# Altium schematic sheet PCB_Schematic_Sheet_3.SchDoc
size A4
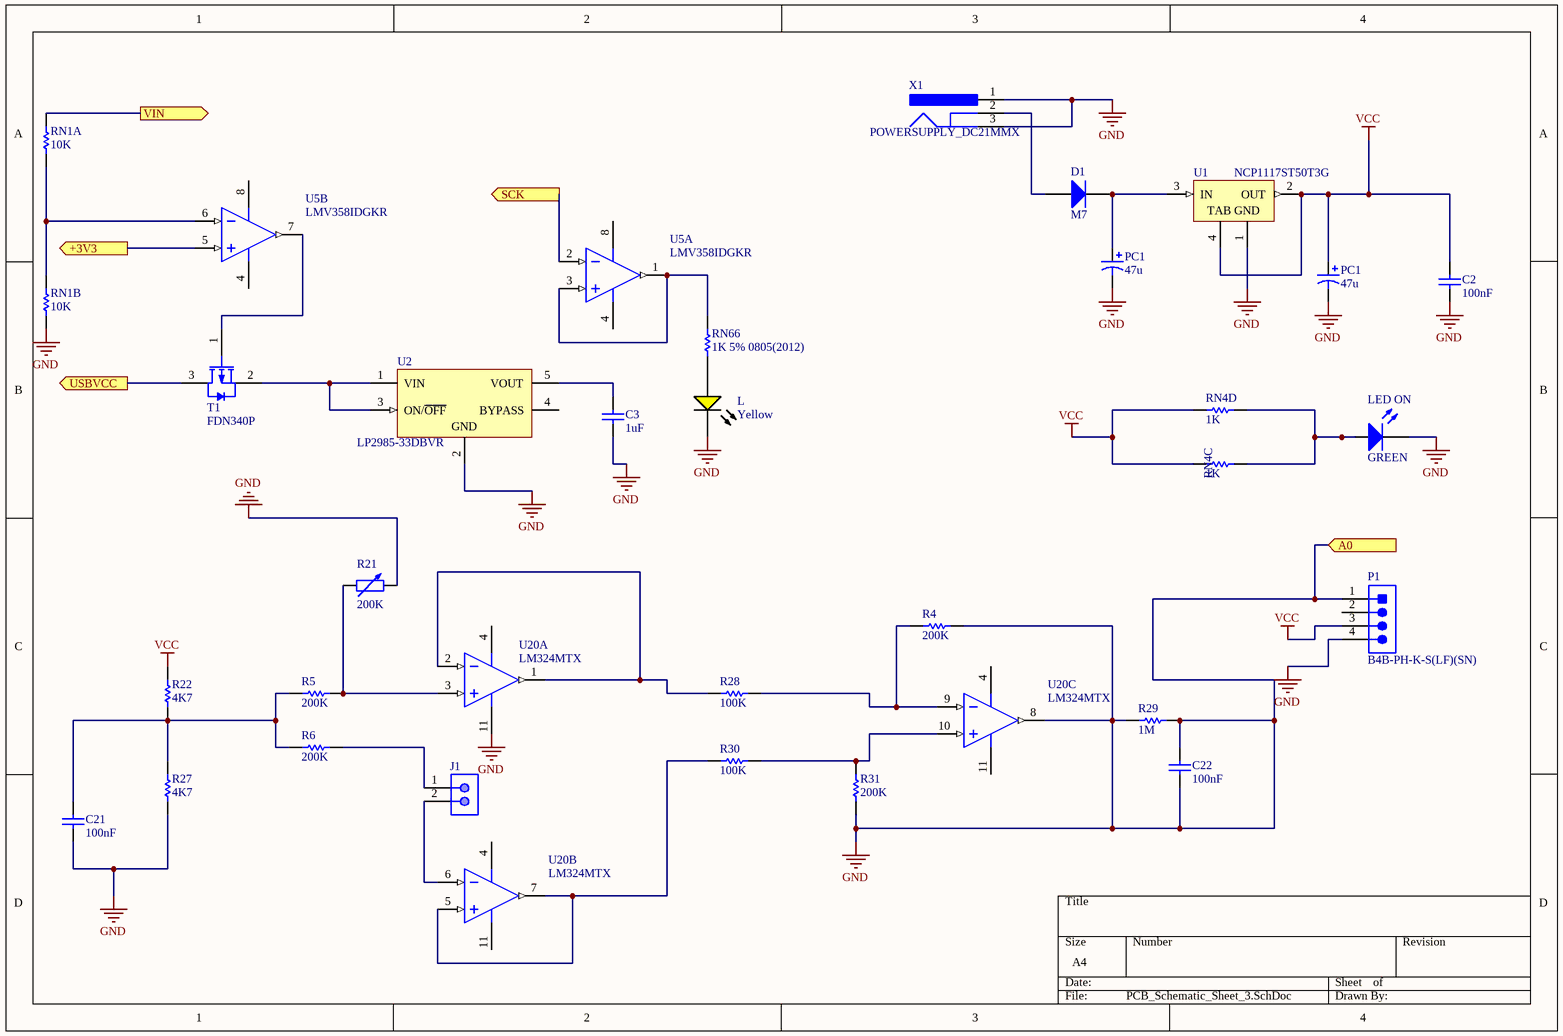
[diagram p0: PCB_Schematic_Sheet_3.SchDoc]

## Parts
(Parts that share a designator on the sheet are numbered #1, #2 ... from top to bottom, then left to right.)
C2  100nF  [CAPC0805(2012)100_M]
C3  1uF  [CAPC0805(2012)145_L]
C21  100nF  [CAPC0603(1608)100_L]
C22  100nF  [CAPC0603(1608)100_L]
D1  M7  [BOUR-CD1206-S01575-2_L]
J1  (no value)  [JST-B2B-XH-A_V]
L  Yellow  [LTST-C190KSKT_V]
LED_ON  GREEN  [3.2X1.6X1.1]
P1  B4B-PH-K-S(LF)(SN)  [JST-B4B-PH-K-S_V]
PC1#1  47u  [PNSC-ECA-1HM470]
PC1#2  47u  [PNSC-ECA-1HM470]
R4  200K  [RESC0603(1608)_M]
R5  200K  [RESC0603(1608)_M]
R6  200K  [RESC0603(1608)_M]
R21  value 200K  [AXIAL-0.6]
R22  4K7  [RESC0603(1608)_N]
R27  4K7  [RESC0603(1608)_N]
R28  100K  [RESC0603(1608)_N]
R29  1M  [RESC0603(1608)_L]
R30  100K  [RESC0603(1608)_N]
R31  200K  [RESC0603(1608)_M]
RN1A  10K  [RESC0805(2012)_M]
RN1B  10K  [RESC0805(2012)_M]
RN4C  1K  [RESC0805(2012)_N]
RN4D  1K  [RESC0805(2012)_N]
RN66  1K 5% 0805(2012)  [RESC0805(2012)_N]
T1  FDN340P  [FAIR-SSOT3L-3_V]
U1  NCP1117ST50T3G  [ONSC-SOT-223_N]
U2  LP2985-33DBVR  [DBV0005A_M]
U5  LMV358IDGKR  [DGK0008A_M]  (parts A,B of 2)
U20  LM324MTX  [PW0014A_N]  (parts A,B,C of 4)
X1  POWERSUPPLY_DC21MMX  [CUI-PJ-102A_V]

## Ports
+3V3 (out), A0 (in), SCK (out), USBVCC (out), VIN (out)

## Nets
GND: C2.1 C3.1 C21.1 C22.1 C22.2 L.2(K) LED_ON.2(K) P1.1 P1.4 PC1#1.2(-) PC1#2.2(-) R4.2 R21.2 R27.1 R29.1 R29.2 R31.1 RN1B.1 U1.1(GND) U2.2(GND) U20.8(OUT3) U20.11(GND) X1.1 X1.3 ; port A0
VCC: C2.2 P1.3 PC1#2.1(+) R22.2 RN4C.1 RN4D.1 U1.2(OUT) U1.4(TAB)
+3V3: U5.5(2IN+) ; port +3V3
SCK: U5.2(1IN-) ; port SCK
USBVCC: T1.3(DRAIN) ; port USBVCC
VIN: RN1A.2 ; port VIN
NetC3_2: C3.2 U2.5(VOUT)
NetC21_2: C21.2 R5.1 R6.1 R22.1 R27.2
NetD1_1: D1.1(A) X1.2
NetD1_2: D1.2(K) PC1#1.1(+) U1.3(IN)
NetJ1_1: J1.1 R6.2
NetJ1_2: J1.2 U20.6(IN2-)
NetL_1: L.1(A) RN66.1
NetLED_ON_1: LED_ON.1(A) RN4C.2 RN4D.2
NetR4_1: R4.1 R28.2 U20.9(IN3-)
NetR5_2: R5.2 R21.1 U20.3(IN1+)
NetR28_1: R28.1 U20.1(OUT1) U20.2(IN1-)
NetR30_1: R30.1 U20.5(IN2+) U20.7(OUT2)
NetR30_2: R30.2 R31.2 U20.10(IN3+)
NetRN1A_1: RN1A.1 RN1B.2 U5.6(2IN-)
NetRN66_2: RN66.2 U5.1(1OUT) U5.3(1IN+)
NetT1_1: T1.1(GATE) U5.7(2OUT)
NetT1_2: T1.2(SOURCE) U2.1(VIN) U2.3(ON/~{OFF})

Not connected (* = marked no-connect by the designer): P1 2; U2 4(BYPASS); U5 4(GND) 8(VCC+); U20 4(V+)

## Library data of the parts
C2 = CMP-1036-04420-1: CAP 100nF 50V ±10% 0805 (2012 Metric) Thickness 1mm SMD; Case-EIA: 0805; Tolerance: Â±10%; Case-Metric: 2012; Rated Voltage: 50 V; Value: 100nF; Max Thickness: 1 mm; Technology: SMT
C3 = CMP-1036-04761-1: CAP 1uF 50V ±10% 0805 (2012 Metric) Thickness 1.45mm SMD; Tolerance: Â±10%; Case-EIA: 0805; Case-Metric: 2012; Technology: SMT; Value: 1uF; Max Thickness: 1.45 mm; Rated Voltage: 50 V
C21 C22 = CMP-1035-02591-1: CAP 100nF 50V ±5% 0603 (1608 Metric) Thickness 1mm SMD; Tolerance: Â±5%; Case-Metric: 1608; Case-EIA: 0603; Rated Voltage: 50 V; Max Thickness: 1 mm; Technology: SMT; Value: 100nF
D1 = CMP-0583-00001-2: 75 V Small Signal Switching Diode, 150 mA, 2.5 uA, 1026 Molded Package, RoHS, Tape and Reel; Manufacturer: Bourns; PartNumber: CD1206-S01575; Reverse Voltage: 75 V; Average Forward Current: 150 mA; Reverse Current (Max.): 2.5 uA; Capacitance Between Terminals (Max.): 3 pF; Reverse Recovery Time (Max.): 4 nS; Forward Voltage (Max.): 1.00 V; Packing: Tape and Reel; Mounting Technology: Surface Mount; DatasheetVersion: Rev. 06/11; ComponentLink2URL: http://www.bourns.com/data/global/pdfs/CD1206_S01575.pdf; PackageReference: CD1206-S01575-2; RoHS: TRUE; ComponentLink1URL: http://www.bourns.com/; ComponentLink1Description: Manufacturer URL; ComponentLink3Description: Package Specification; ComponentLink3URL: http://www.bourns.com/data/global/pdfs/CD1206_S01575.pdf; ComponentLink2Description: Datasheet; PackageDescription: 2-Pin SMD, Body 3.2 x 1.5 mm
J1 = CMP-2000-05888-1: Male Header, Pitch 2.5 mm, 1 x 2 Position, Height 7 mm, Tail Length 3.4 mm, -25 to 85 degC, RoHS, Bulk; Manufacturer: JST; No of Positions: 2; Pitch: 2.5mm; Style/Orientation: StraightHeader/Plug; Datasheet Version: 05/2016; Package Description: Male Header, Pitch 2.5 mm, 1 x 2 Position, Height 7 mm, Tail Length 3.4 mm; Package Reference: B2B-XH-A; Mounting Technology: ThroughHole; Type: ShroudedHeader; Datasheet URL: http://www.jst-mfg.com/product/pdf/eng/eXH.pdf; Manufacturer URL: http://www.jst.com/home2.html; Termination: Crimp
L = CMP-1674-00009-1: LED Uni-Color Yellow, 75 mW, 30 mA, -30 to 85 degC, 2-Pin SMD, RoHS, Tape and Reel; Voltage Rating: 50 V; Case\Package: 0603; Power Rating: 100 mW; Tolerance: 1%; Resistance: 12 kohm; Packaging: Tape and Reel; RoHSCompliant: true; Height: 0.45 mm; Max Operating Temperature: 155 degC; Mount: Surface Mount; DatasheetVersion: Rev. I, 10/2012; Min Operating Temperature: -55 degC; PackageReference: C190KSKT; ComponentLink1Description: Manufacturer URL; Length: 1.6 mm; REACH SVHC: No SVHC; Case Code (Imperial): 0603; Voltage Rating (DC): 50 V; PackageDescription: 2-Pin Surface Mount Device, Body 1.6 x 0.8 mm; Case Code (Metric): 1608; Package Quantity: 5000; ComponentLink2Description: Datasheet; Width: 0.8 mm; Pins: 2; ComponentLink2URL: http://optoelectronics.liteon.com/upload/download/DS-22-99-0189/S_110_LTST-C190KSKT.pdf; ComponentLink1URL: http://www.us.liteon.com/
LED_ON = LED2: Typical RED, GREEN, YELLOW, AMBER GaAs LED; Published: 8-Jun-2000; LatestRevisionDate: 17-Jul-2002; LatestRevisionNote: Re-released for DXP Platform.; PackageVersion: Feb-2002; PackageReference: 3.2X1.6X1.1; Publisher: Altium Limited; PackageDescription: SM LED; 2 Flat Leads
P1 = CMP-2000-05165-1: Male Header, Pitch 2 mm, 1 x 4 Position, Height 6 mm, Tail Length 3.4 mm, -25 to 85 degC, RoHS, Bulk; Manufacturer: JST; No of Positions: 4; Style/Orientation: StraightHeader/Plug; Pitch: 2mm; Datasheet URL: http://datasheet.octopart.com/B4B-PH-K-S%28LF%29%28SN%29-JST-datasheet-10558886.pdf; Type: ShroudedHeader; Manufacturer URL: http://www.jst.com/home2.html; Termination: Crimp; Datasheet Version: Apr-09
PC1#1 PC1#2 = CMP-1665-00013-1: CAP ALUM 47UF 50V 20% RADIAL; PartNumber: ECA-1HM470; PackageReference: ECA-1HM470; ComponentLink1Description: Datasheet; ComponentLink1URL: http://industrial.panasonic.com/cdbs/www-data/pdf/RDF0000/ABA0000C1047.pdf
R4-R6 R31 = CMP-1012-00129-1: 200K 0.1W 5% 0603 (1608 Metric)  SMD; Case-EIA: 0603; Value: 200000.00 Ohm; Case-Metric: 1608; Technology: SMT; Power: 0.1 W; Tolerance: 5 %
R21 = Res Adj2: Variable Resistor; Set Position: 0.5; Published: 8-Jun-2000; LatestRevisionDate: 17-Jul-2002; LatestRevisionNote: Re-released for DXP Platform.; PackageReference: AXIAL-0.6; Publisher: Altium Limited; PackageDescription: Axial Device, Thru-Hole; 2 Leads; 0.6 in Pin Spacing
R22 R27 = CMP-1012-00090-1: 4K7 0.1W 5% 0603 (1608 Metric)  SMD; Case-Metric: 1608; Value: 4700.00 Ohm; Case-EIA: 0603; Tolerance: 5 %; Technology: SMT; Power: 0.1 W
R28 R30 = CMP-1012-00122-1: 100K 0.1W 5% 0603 (1608 Metric)  SMD; Case-EIA: 0603; Value: 100000.00 Ohm; Case-Metric: 1608; Tolerance: 5 %; Power: 0.1 W; Technology: SMT
R29 = CMP-1012-00849-1: 1M 0.1W 1% 0603 (1608 Metric)  SMD; Value: 1000000.00 Ohm; Case-EIA: 0603; Case-Metric: 1608; Power: 0.1 W; Tolerance: 1 %; Technology: SMT
RN1A RN1B = CMP-1013-00623-1: 10K 0.125W 1% 0805 (2012 Metric)  SMD; Value: 10000.00 Ohm; Case-Metric: 2012; Case-EIA: 0805; Tolerance: 1 %; Power: 0.125 W; Technology: SMT
RN4C RN4D RN66 = CMP-1013-00074-1: 1K 0.125W 5% 0805 (2012 Metric)  SMD; Case-EIA: 0805; Case-Metric: 2012; Value: 1000.00 Ohm; Technology: SMT; Power: 0.125 W; Tolerance: 5 %
T1 = CMP-2100-03638-1: Single P-Channel, Logic Level, PowerTrench(R) MOSFET, 2 A, 20 V, -55 to 150 degC, 3-Pin SOT-23, RoHS, Tape and Reel; Manufacturer: Fairchild Semiconductor; Fall Time: 11ns; Current Rating: -2A; Turn-On Delay Time: 10ns; Drain to Source Breakdown Voltage: -20V; Drain to Source Resistance: 60mOhm; Gate to Source Voltage (Vgs): 8V; Threshold Voltage: -800mV; Rds On Max: 70mOhm; Package Version: Rev. 3, 05/2015; Turn-Off Delay Time: 27ns; Power Dissipation: 500mW; Number of Elements: 1; Drain to Source Voltage (Vdss): 20V; Rise Time: 9ns; Input Capacitance: 779pF; Continuous Drain Current (ID): 2A; Radiation Hardening: No; Contact Plating: Tin; Mount: SurfaceMount; REACH SVHC: NoSVHC; Manufacturer URL: https://www.fairchildsemi.com/; Width: 3.05mm; Height: 0.94mm; Voltage Rating (DC): -20V; Package Quantity: 1; Case/Package: SOT-23; Package Reference: SSOT3L; Lead Free: LeadFree; Datasheet Version: Rev. E1, 02/2007; Termination: SMD/SMT; Package URL: https://www.fairchildsemi.com/package-drawings/MA/MA03B.pdf; Packaging: TapeandReel; Number of Pins: 3; RoHSCompliant: true; Datasheet URL: https://www.fairchildsemi.com/datasheets/FD/FDN340P.pdf; Max Operating Temperature: 150degC; Element Configuration: Single; Min Operating Temperature: -55degC; Length: 2.92mm; Package Description: 3-Pin Small Outline Transistor, Body 2.92 x 1.4 mm, Pitch 0.95 mm; Max Power Dissipation: 500mW
U1 = CMP-0592-00001-2: 1.0 A Low-Dropout Positive Fixed Voltage Regulator, 5 V Vout, 0 to 125 degC, 4-Pin SOT-223, Pb-Free, Tape and Reel; Manufacturer: ON Semiconductor; IQ: 6 mA; Iout (Min): 1 A; Nominal Output Voltage: 5 V; Vin: 20 V; RR: 61 dB; Dropout Voltage: 1.2 V; PartNumber: NCP1117ST50T3G; Packing: Tape and Reel; DatasheetVersion: Rev. 26; ComponentLink3URL: http://www.onsemi.com/pub_link/Collateral/318H-01.PDF; ComponentLink2URL: http://www.onsemi.com/pub_link/Collateral/NCP1117-D.PDF; Mounting Technology: Surface Mount; ComponentLink2Description: Datasheet; Operating Temperature: 0 to 125 degC; ComponentLink1Description: Manufacturer URL; PackageDescription: 4-Pin Small Out-Line Transistor, Body 3.5 x 6.5 mm, Pitch 2.3 mm; ComponentLink1URL: http://www.onsemi.com/; PackageReference: SOT-223; ComponentLink3Description: Package Specification
U2 = CMP-0758-00080-2: Single Output Low Noise LDO, 150 mA, Fixed 3.3 V Output, 1.5% Tolerance, 2.2 to 16 V Input, Low IQ, 5-Pin SOT-23 (DBV), -40 to 125 degC, Green (RoHS & no Sb/Br), Tape and Reel; Manufacturer: Texas Instruments; Vdo (Typ) (mV): 280; Accuracy (%): 1.5; Output Options: Fixed Output; Fixed Output Options (V): 3.3; Iout (Max) (A): 0.15; Iq (Typ) (mA): 0.85; ComponentLink3Description: Package Specification; Packing: Tape and Reel; ComponentLink3URL: http://www.ti.com/litv/pdf/mpds018j; Vin (V): 2.2 to 16; Mounting Technology: Surface Mount; ComponentLink1URL: http://www.ti.com/; PartNumber: LP2985-33DBVR; PackageReference: DBV0005A; ComponentLink2URL: http://www.ti.com/lit/ds/symlink/lp2985-50.pdf; RoHS: TRUE; ComponentLink2Description: Datasheet; PackageVersion: 4073253-4/L; Operating Temperature Range (degC): -40 to 125; DatasheetVersion: SLVS522N; ComponentLink1Description: Manufacturer URL; PackageDescription: 5-Pin Plastic Small Outline, Body 2.9 x 1.6 mm, Pitch 0.95 mm
U5 = CMP-2100-03651-1: Low-Voltage Rail-to-Rail Output Operational Amplifier, 2.7 to 5.5 V, -40 to 125 degC, 8-Pin VSSOP (DGK), Green (RoHS & no Sb/Br), Tape and Reel; Manufacturer: Texas Instruments; Unity Gain Bandwidth Product: 1MHz; Common Mode Rejection Ratio: 50dB; Operating Supply Current: 210uA; Number of Circuits: 2; Input Offset Voltage (Vos): 7mV; Voltage Gain: 100dB; Supply Voltage: 5V; Nominal Supply Current: 440uA; Input Bias Current: 250nA; Min Supply Voltage: 2.7V; Max Supply Voltage: 5.5V; Slew Rate: 1V/us; Output Current per Channel: 160mA; Width: 3mm; Package Description: 8-Pin Thin Small Outline Package, Body 3 x 3 mm, Pitch 0.65 mm; Packaging: TapeandReel; REACH SVHC: NoSVHC; Number of Pins: 8; Length: 3mm; Lead Free: LeadFree; Height: 0.97mm; Package URL: http://www.ti.com/litv/pdf/mpds028d; Number of Channels: 2; Number of Elements: 2; Datasheet URL: http://www.ti.com/lit/ds/symlink/lmv358.pdf; Datasheet Version: SLOS263W, 10/2014; Case/Package: MSOP; Bandwidth: 1MHz; Gain Bandwidth Product: 1MHz; Number of Amplifiers: 2; Max Operating Temperature: 85degC; Mount: SurfaceMount; RoHSCompliant: true; Package Reference: DGK0008A; Min Operating Temperature: -40degC; Radiation Hardening: No; Contact Plating: Gold; Package Quantity: 1; Output Current: 160mA; Manufacturer URL: http://www.ti.com/
U20 = CMP-0055-01359-3: Low Power Quad Operational Amplifier, 14-pin TSSOP; Manufacturer: Texas Instruments; PowerWise: N; CompType: Amplifiers; PackageTopMarking: NSZXYTT*LM324*MT; PackageDescription: Molded TSSOP, JEDEC, 5 x 4.4 x 0.9mm Body, 14 Lead, 0.65mm Pitch; ComponentLink1Description: Datasheet URL; PinCount: 14; Code_JEDEC: MO-153-AB-1; RoHS: N; ComponentLink1URL: http://www.ti.com/general/docs/lit/getliterature.tsp?genericPartNumber=LM324-N&fileType=pdf; Package Reference: PW0014A
X1 = CMP-2000-06899-1: DC Power Jack, 2.5 A, -25 to 85 degC, 3-Pin THD, RoHS; Manufacturer: CUIInc.; Insulation Resistance: 50MOhms; Current Rating: 2.5A; Inside Contact Diameter: 2mm; Outside Contact Diameter: 6.5mm; Brand: CUI; Mounting Angle: Right; Voltage Rating: 24V; Package Description: 3-Pin Through Hole Device, Body 14.4 x 9 mm, Pitch 3 mm; Factory Pack Quantity: 280; Connector Type: DCPowerJack; Contact Plating: Nickel; Manufacturer URL: http://www.cui.com/; Flammability Rating: UL94V-0; Datasheet URL: http://www.mouser.com/ds/2/670/PJ-102A-524195.pdf; Termination Style: ThroughHole; Product: Jacks; Package Reference: PJ-102A; Datasheet Version: Rev. 1.03, 04/2016; Housing Material: PolybutyleneTerephthalate(PBT); Mounting Style: ThroughHole; RoHS: True; Operating Temperature Range: -25Cto+85C; Contact Gender: Male; Contact Material: Copper; Product Category: DCPowerConnectors; Package URL: http://www.infineon.com/dgdl/Datasheet_TLE8201_Rev20.pdf?folderId=db3a304412b407950112b408e8c90004&fileId=db3a304412b407950112b409a5f20326&sId=db3a30443d67b5ca013d7cbf680d1c42; Mounting Technology: ThroughHole